# EAGLE design PinballBumper_DaughterBoard (EAGLE 9.0.1)
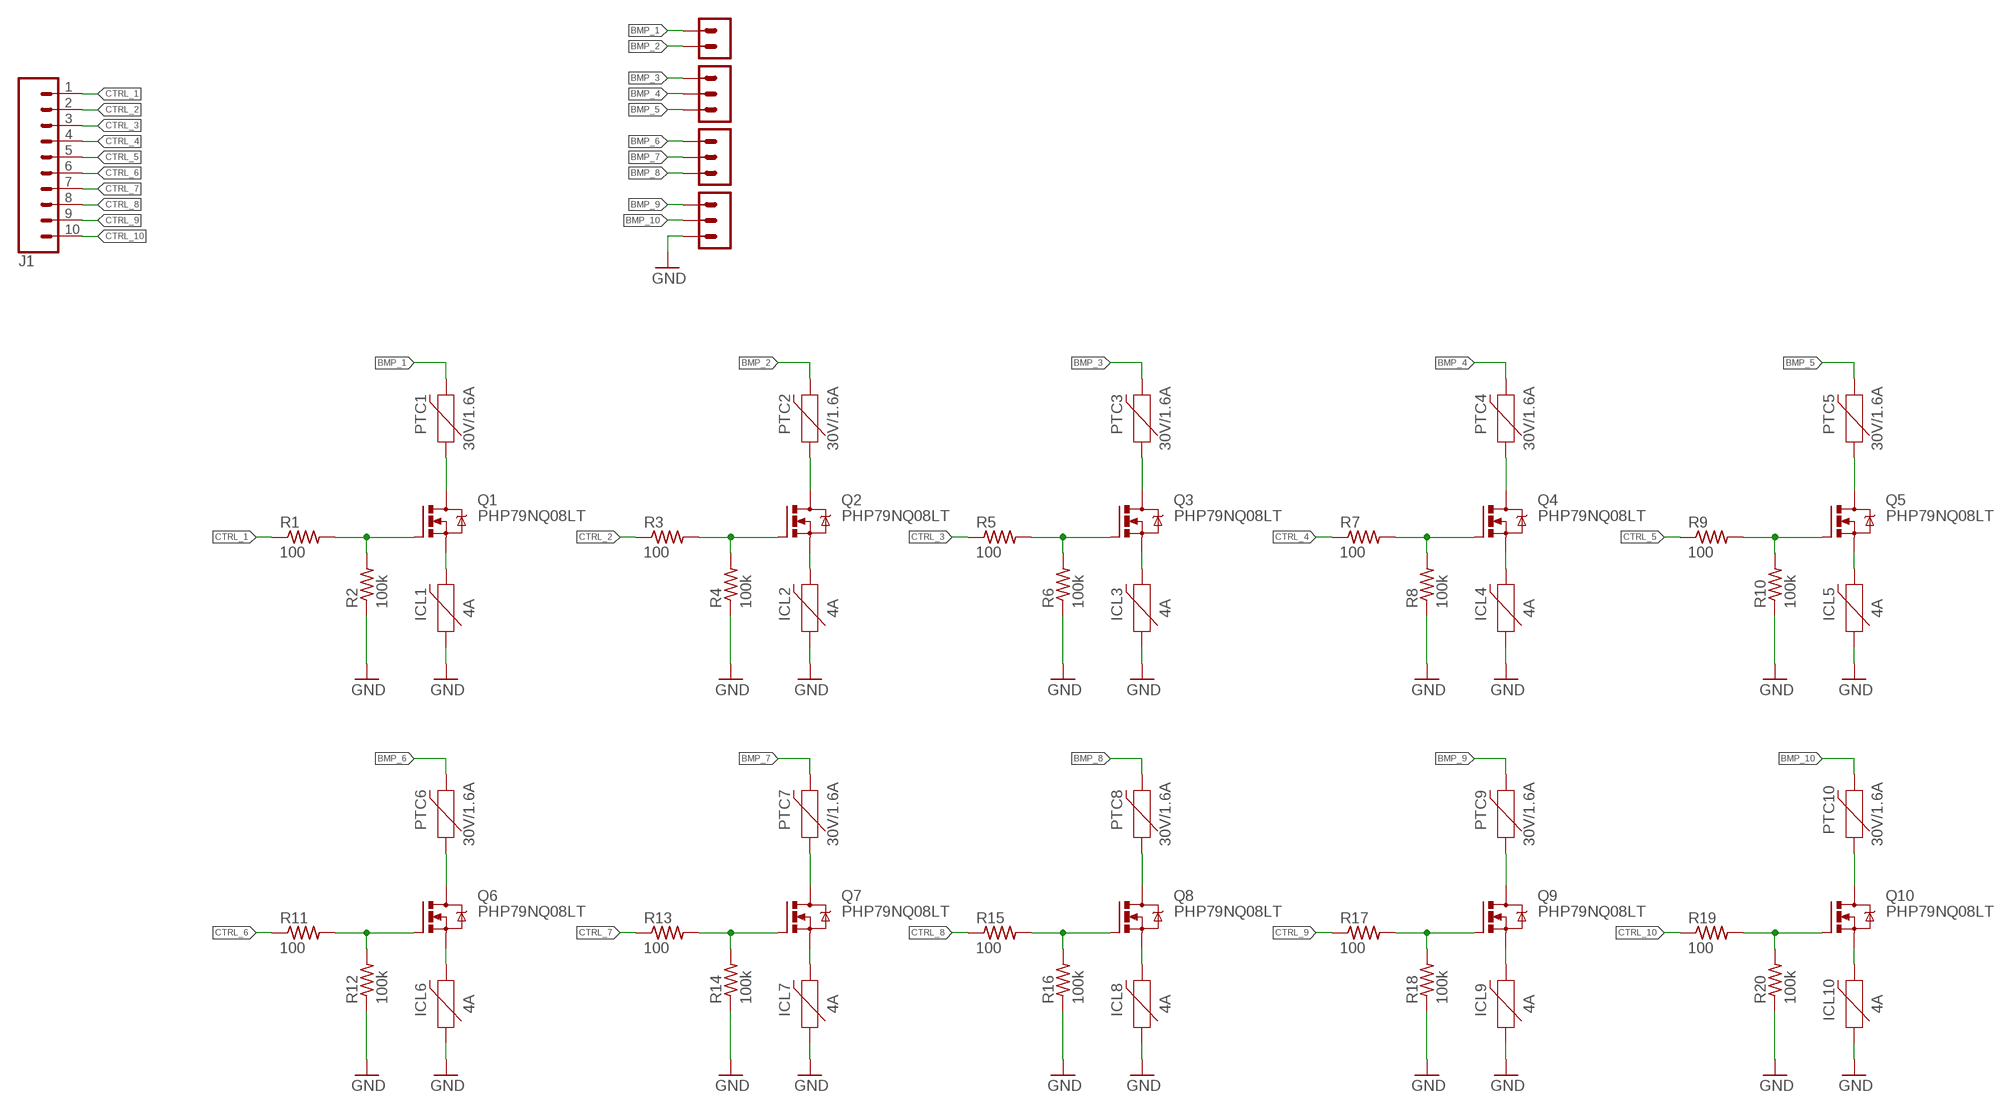
[diagram p0: schematic, sheet 1]

## Parts
ICL1  4A  PPTC_PTH  [PTH]
ICL2  4A  PPTC_PTH  [PTH]
ICL3  4A  PPTC_PTH  [PTH]
ICL4  4A  PPTC_PTH  [PTH]
ICL5  4A  PPTC_PTH  [PTH]
ICL6  4A  PPTC_PTH  [PTH]
ICL7  4A  PPTC_PTH  [PTH]
ICL8  4A  PPTC_PTH  [PTH]
ICL9  4A  PPTC_PTH  [PTH]
ICL10  4A  PPTC_PTH  [PTH]
J1  CONN_10"  [1X10]
PTC1  30V/1.6A  PPTC_PTH  [PTH]
PTC2  30V/1.6A  PPTC_PTH  [PTH]
PTC3  30V/1.6A  PPTC_PTH  [PTH]
PTC4  30V/1.6A  PPTC_PTH  [PTH]
PTC5  30V/1.6A  PPTC_PTH  [PTH]
PTC6  30V/1.6A  PPTC_PTH  [PTH]
PTC7  30V/1.6A  PPTC_PTH  [PTH]
PTC8  30V/1.6A  PPTC_PTH  [PTH]
PTC9  30V/1.6A  PPTC_PTH  [PTH]
PTC10  30V/1.6A  PPTC_PTH  [PTH]
Q1  PHP79NQ08LT  IRF740  [TO220BV]
Q2  PHP79NQ08LT  IRF740  [TO220BV]
Q3  PHP79NQ08LT  IRF740  [TO220BV]
Q4  PHP79NQ08LT  IRF740  [TO220BV]
Q5  PHP79NQ08LT  IRF740  [TO220BV]
Q6  PHP79NQ08LT  IRF740  [TO220BV]
Q7  PHP79NQ08LT  IRF740  [TO220BV]
Q8  PHP79NQ08LT  IRF740  [TO220BV]
Q9  PHP79NQ08LT  IRF740  [TO220BV]
Q10  PHP79NQ08LT  IRF740  [TO220BV]
R1  100  R-US_0204/7  [0204/7]
R2  100k  R-US_0204/7  [0204/7]
R3  100  R-US_0204/7  [0204/7]
R4  100k  R-US_0204/7  [0204/7]
R5  100  R-US_0204/7  [0204/7]
R6  100k  R-US_0204/7  [0204/7]
R7  100  R-US_0204/7  [0204/7]
R8  100k  R-US_0204/7  [0204/7]
R9  100  R-US_0204/7  [0204/7]
R10  100k  R-US_0204/7  [0204/7]
R11  100  R-US_0204/7  [0204/7]
R12  100k  R-US_0204/7  [0204/7]
R13  100  R-US_0204/7  [0204/7]
R14  100k  R-US_0204/7  [0204/7]
R15  100  R-US_0204/7  [0204/7]
R16  100k  R-US_0204/7  [0204/7]
R17  100  R-US_0204/7  [0204/7]
R18  100k  R-US_0204/7  [0204/7]
R19  100  R-US_0204/7  [0204/7]
R20  100k  R-US_0204/7  [0204/7]
U$1  BIG_TERMINAL_2PINBIG  [BIG_TERMINAL_2PIN]
U$2  BIG_TERMINAL_3PINBIG  [BIG_TERMINAL_3PIN]
U$3  BIG_TERMINAL_3PINBIG  [BIG_TERMINAL_3PIN]
U$4  BIG_TERMINAL_3PINBIG  [BIG_TERMINAL_3PIN]

## Nets
BMP_1: PTC1.P$2 U$1.P$1
BMP_2: PTC2.P$2 U$1.P$2
BMP_3: PTC3.P$2 U$2.1
BMP_4: PTC4.P$2 U$2.2
BMP_5: PTC5.P$2 U$2.3
BMP_6: PTC6.P$2 U$3.1
BMP_7: PTC7.P$2 U$3.2
BMP_8: PTC8.P$2 U$3.3
BMP_9: PTC9.P$2 U$4.1
BMP_10: PTC10.P$2 U$4.2
CTRL_1: J1.1 R1.1
CTRL_2: J1.2 R3.1
CTRL_3: J1.3 R5.1
CTRL_4: J1.4 R7.1
CTRL_5: J1.5 R9.1
CTRL_6: J1.6 R11.1
CTRL_7: J1.7 R13.1
CTRL_8: J1.8 R15.1
CTRL_9: J1.9 R17.1
CTRL_10: J1.10 R19.1
GND: ICL1.P$1 ICL2.P$1 ICL3.P$1 ICL4.P$1 ICL5.P$1 ICL6.P$1 ICL7.P$1 ICL8.P$1 ICL9.P$1 ICL10.P$1 R2.1 R4.1 R6.1 R8.1 R10.1 R12.1 R14.1 R16.1 R18.1 R20.1 U$4.3
N$1: PTC1.P$1 Q1.D
N$2: Q1.G R1.2 R2.2
N$3: ICL1.P$2 Q1.S
N$4: PTC2.P$1 Q2.D
N$5: Q2.G R3.2 R4.2
N$6: ICL2.P$2 Q2.S
N$7: PTC3.P$1 Q3.D
N$8: Q3.G R5.2 R6.2
N$9: ICL3.P$2 Q3.S
N$10: PTC4.P$1 Q4.D
N$11: Q4.G R7.2 R8.2
N$12: ICL4.P$2 Q4.S
N$13: PTC5.P$1 Q5.D
N$14: Q5.G R9.2 R10.2
N$15: ICL5.P$2 Q5.S
N$16: PTC6.P$1 Q6.D
N$17: Q6.G R11.2 R12.2
N$18: ICL6.P$2 Q6.S
N$19: PTC7.P$1 Q7.D
N$20: Q7.G R13.2 R14.2
N$21: ICL7.P$2 Q7.S
N$22: PTC8.P$1 Q8.D
N$23: Q8.G R15.2 R16.2
N$24: ICL8.P$2 Q8.S
N$25: PTC9.P$1 Q9.D
N$26: Q9.G R17.2 R18.2
N$27: ICL9.P$2 Q9.S
N$28: PTC10.P$1 Q10.D
N$29: Q10.G R19.2 R20.2
N$30: ICL10.P$2 Q10.S

## Library data of the parts
ICL1-ICL10 PTC1-PTC10 = SparkFun-Fuses:PPTC: Resettable Fuse PPTC Resettable Fuse. Really a sort of resistor with a polymeric positive temperature coefficient whose resistance increases dramatically with an increase in temperature. When heated by the power passing through the resistance rises causing the current to be limited, protecting the circuit. This is achieved by the transition of the polymer from a crystalline to an amorphous state where the conductive carbon separates breaking the conductive pathways found in the cool crystalline structure. When a PPTC cools back down it resumes conducting letting the circuit turn back on. SparkFun Products: SparkFun RedBoard - Programmed with Arduino <https://www.sparkfun.com/products/12757> Pro Micro - 5V/16MHz <https://www.sparkfun.com/products/12640> Arduino Pro 328 - 5V/16MHz <https://www.sparkfun.com/products/10915> MP3 Trigger <https://www.sparkfun.com/products/13720>; PROD_ID: RES-08490; VALUE: 72V/0.25A
J1 = SparkFun-Connectors:CONN_10: Multi connection point. Often used as Generic Header-pin footprint for 0.1 inch spaced/style header connections On any of the 0.1 inch spaced packages, you can populate with these: Break Away Headers - Straight <https://www.sparkfun.com/products/116> (PRT-00116) Break Away Male Headers - Right Angle <https://www.sparkfun.com/products/553> (PRT-00553) Female Headers <https://www.sparkfun.com/products/115> (PRT-00115) Break Away Headers - Machine Pin <https://www.sparkfun.com/products/117> (PRT-00117) Break Away Female Headers - Swiss Machine Pin <https://www.sparkfun.com/products/743> (PRT-00743) Arduino Stackable Header - 10 Pin <https://www.sparkfun.com/products/11376> (PRT-11376) For SCREWTERMINALS and SPRING TERMINALS visit here: Screw Terimnals on SparkFun.com <https://www.sparkfun.com/search/results?term=Screw+Terminals> (5mm/3.5mm/2.54mm spacing) This device is also useful as a general connection point to wire up your design to another part of your project. Our various solder wires solder well into these plated through hole pads. Hook-Up Wire - Assortment (Stranded, 22 AWG) <https://www.sparkfun.com/products/11375> (PRT-11375) Hook-Up Wire - Assortment (Solid Core, 22 AWG) <https://www.sparkfun.com/products/11367> (PRT-11367) View the entire wire category on our website here <https://www.sparkfun.com/categories/141> Special notes: Molex polarized connector foot print use with SKU : PRT-08231 with associated crimp pins and housings. 1MM SMD Version SKU: PRT-10208 NOTES ON THE VARIANTS LOCK and LOCK_LONGPADS... This footprint was designed to help hold the alignment of a through-hole component (i.e. 6-pin header) while soldering it into place. You may notice that each hole has been shifted either up or down by 0.005 of an inch from it's more standard position (which is a perfectly straight line). This slight alteration caused the pins (the squares in the middle) to touch the edges of the holes. Because they are alternating, it causes a "brace" to hold the component in place. 0.005 has proven to be the perfect amount of "off-center" position when using our standard breakaway headers. Although looks a little odd when you look at the bare footprint, once you have a header in there, the alteration is very hard to notice. Also,if you push a header all the way into place, it is covered up entirely on the bottom side.; PROD_ID: CONN-11563
Q1-Q10 = transistor-power:IRF740: N-CHANNEL MOS FET
R1-R20 = rcl:R-US_: RESISTOR, American symbol; SPICEPREFIX: R
U$1 = EzerLonginus:BIG_TERMINAL_2PIN
U$2-U$4 = EzerLonginus:BIG_TERMINAL_3PIN

## Board
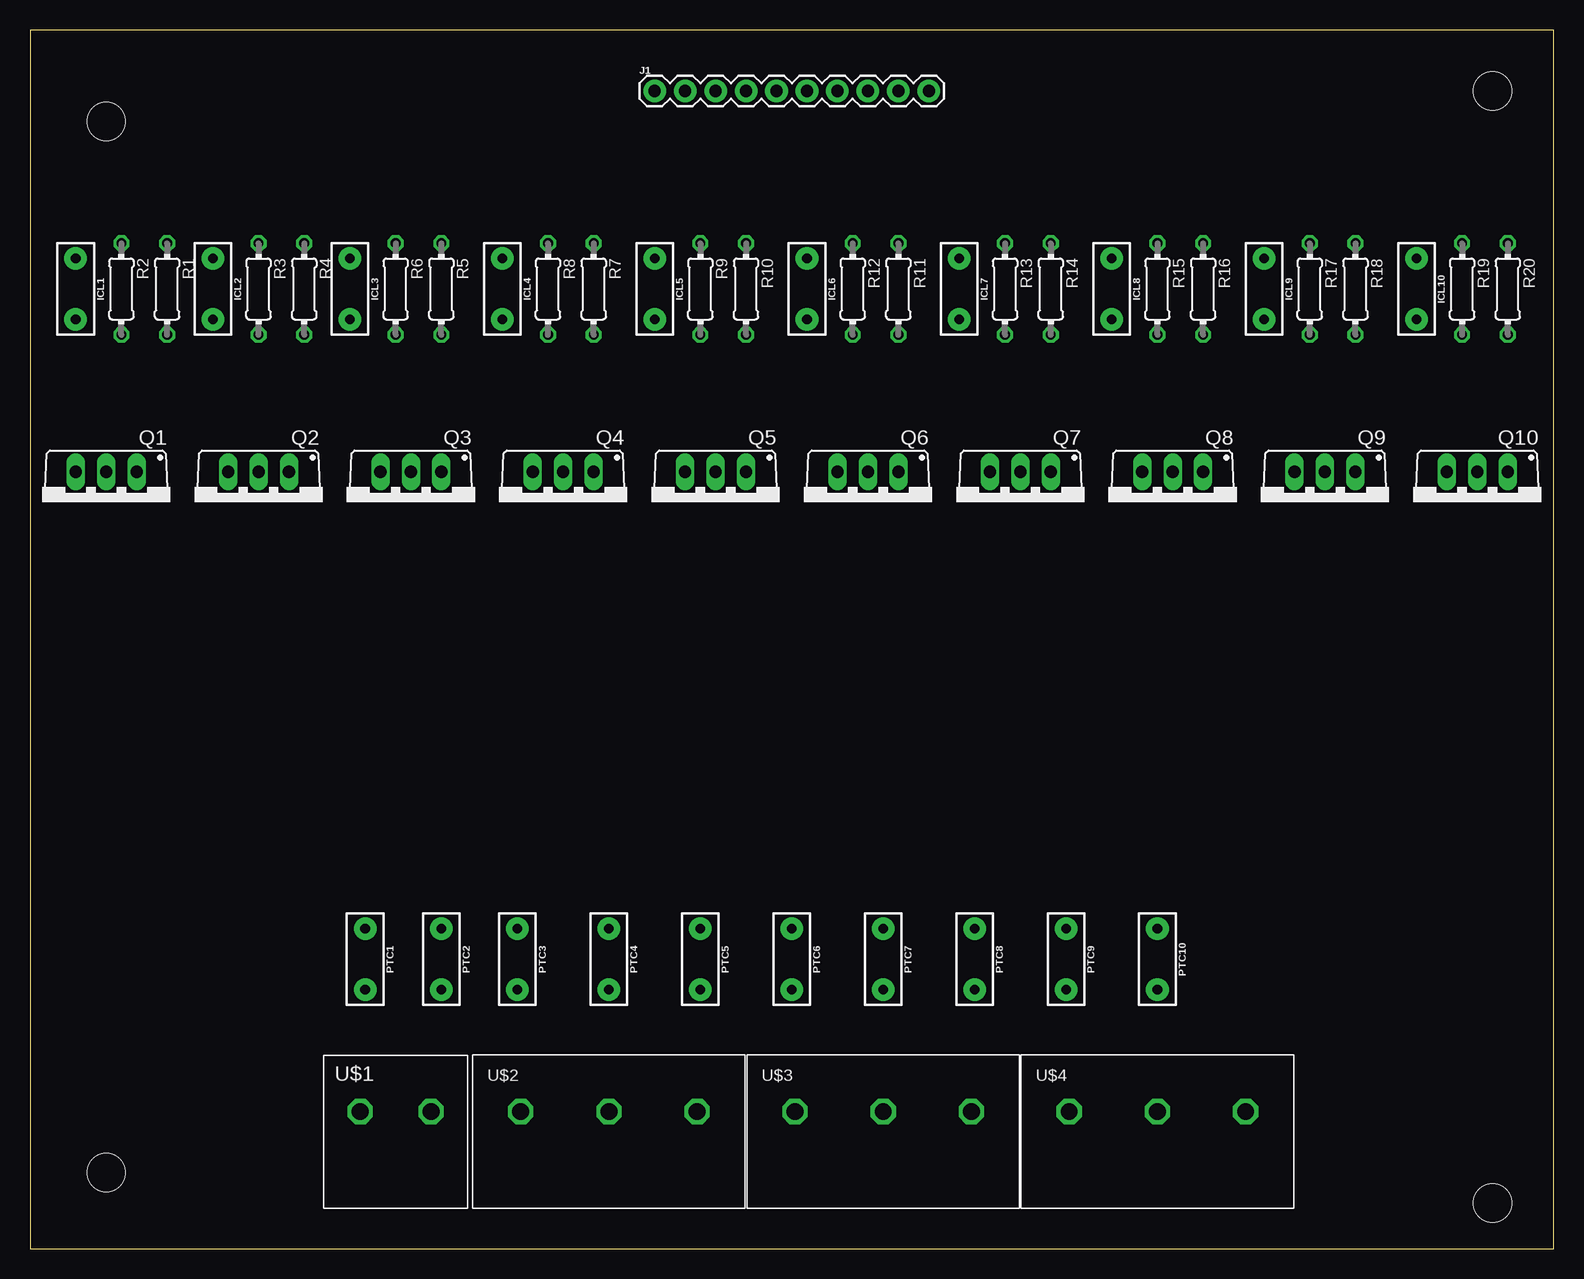
[diagram p1: board, top side]
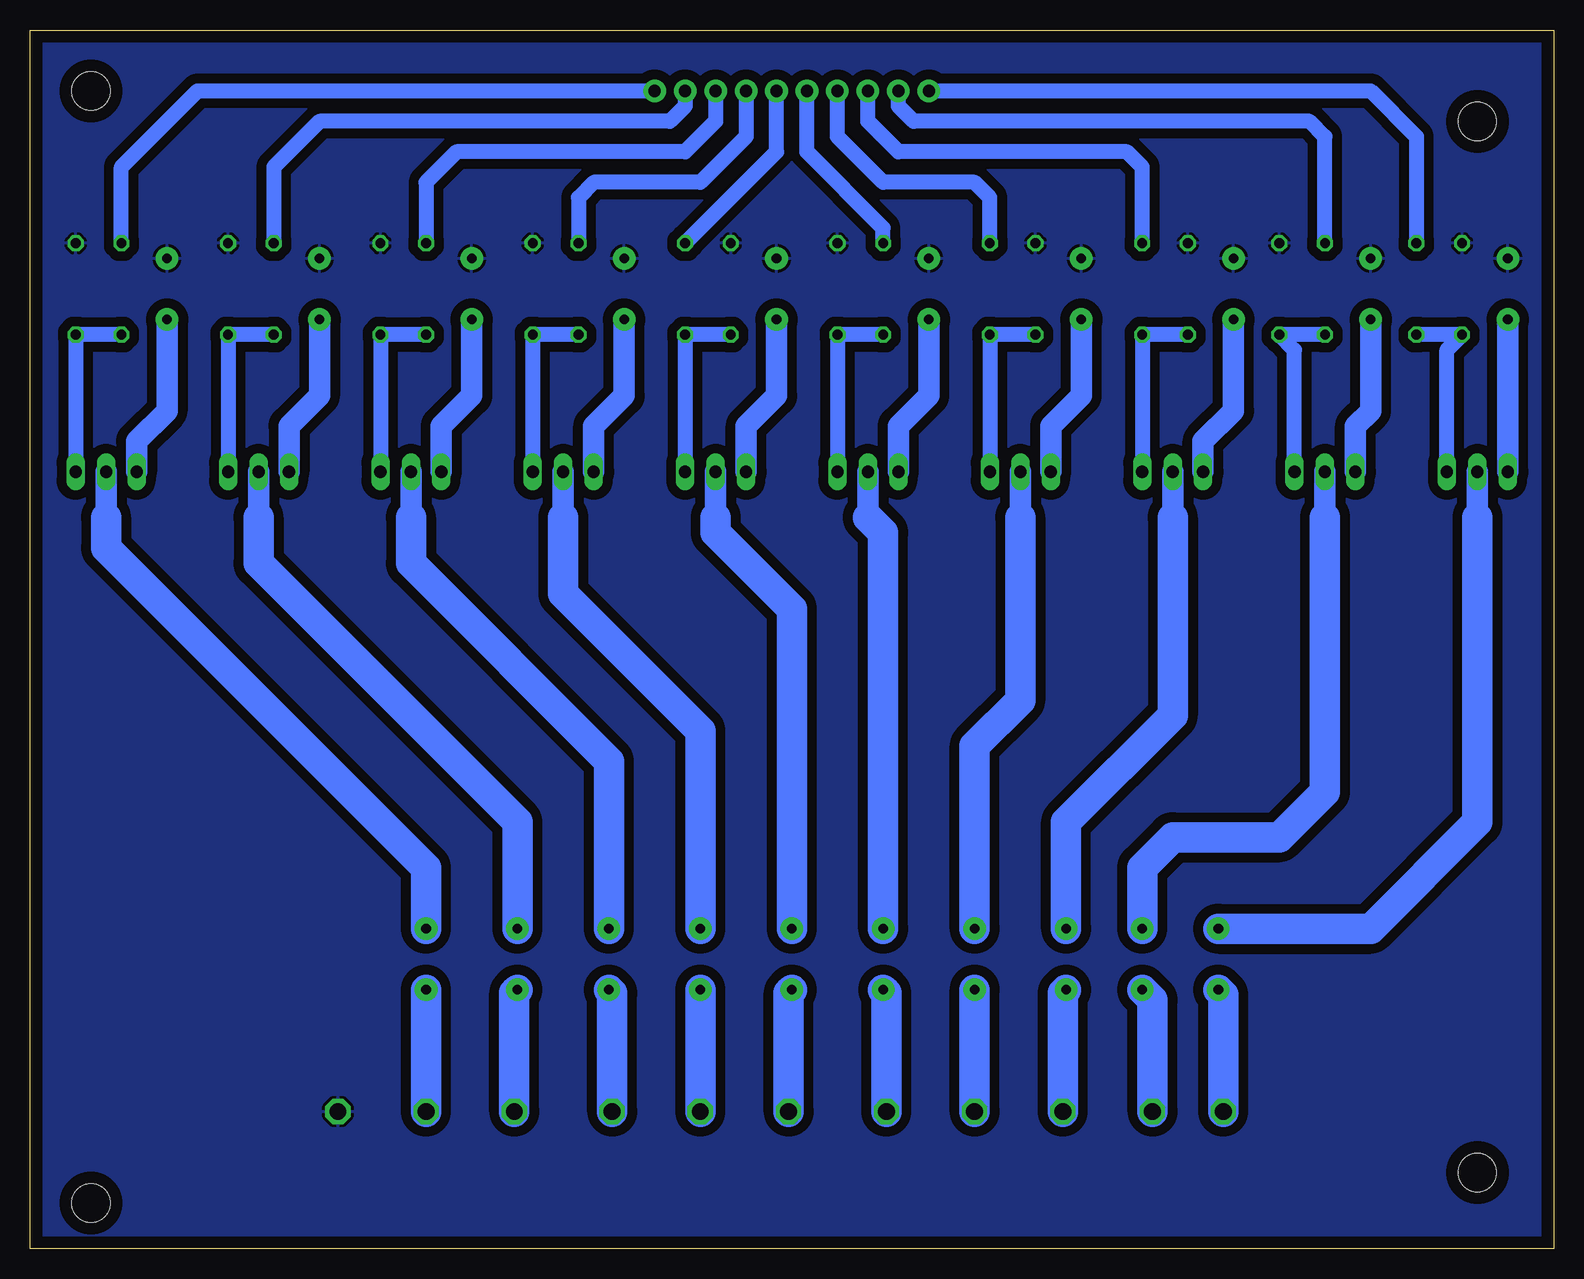
[diagram p2: board, bottom side, seen from below]

Size 127 x 101.6 mm. Coordinates in mm from the lower left corner, seen from the top.
Outline: 0,0 127,0 127,101.6 0,101.6 0,0
Copper layers (1*16): Top 0.035mm / dielectric 1.5mm / Bottom 0.035mm
Design rules "default": minimum track width 6mil, minimum drill 0.35mm, track to track 6mil, track to pad 6mil, pad to pad 6mil, via to via 6mil, smd to smd 6mil, copper to edge 40mil, drill to drill 6mil, minimum pad ring 10mil, minimum via ring 8mil, stop-mask expansion 4mil, vias tented up to drill 0mil, thermal gap 10mil
Holes 3.17 mm at 6.35,93.98 6.35,6.35 121.92,96.52 121.92,3.81

### Footprints (pad centres in the part's own frame; a part is rotated, then mirrored left to right if it is on the bottom)
PTH = drill 0.8 pad 1.88: P$1 -2.54,0; P$2 2.54,0
1X10 = drill 1.016 pad 1.88: 1 0,0; 2 2.54,0; 3 5.08,0; 4 7.62,0; 5 10.16,0; 6 12.7,0; 7 15.24,0; 8 17.78,0; 9 20.32,0; 10 22.86,0
TO220BV = drill 1.016 long: D 0,-2.54; G -2.54,-2.54; S 2.54,-2.54
0204/7 = drill 0.813 octagon: 1 -3.81,0; 2 3.81,0
BIG_TERMINAL_2PIN = drill 1.397 octagon: P$1 -2.953,0; P$2 2.953,0
BIG_TERMINAL_3PIN = drill 1.397 octagon: 1 -7.353,0; 2 0,0; 3 7.353,0

### Placement (x,y rotation side)
ICL1  3.81,80.01 270 top
ICL2  15.24,80.01 270 top
ICL3  26.67,80.01 270 top
ICL4  39.37,80.01 270 top
ICL5  52.07,80.01 270 top
ICL6  64.77,80.01 270 top
ICL7  77.47,80.01 270 top
ICL8  90.17,80.01 270 top
ICL9  102.87,80.01 270 top
ICL10  115.57,80.01 270 top
J1  52.07,96.52 0 top
PTC1  27.94,24.13 270 top
PTC2  34.29,24.13 270 top
PTC3  40.64,24.13 270 top
PTC4  48.26,24.13 270 top
PTC5  55.88,24.13 270 top
PTC6  63.5,24.13 270 top
PTC7  71.12,24.13 270 top
PTC8  78.74,24.13 270 top
PTC9  86.36,24.13 270 top
PTC10  93.98,24.13 270 top
Q1  6.35,62.23 180 top
Q2  19.05,62.23 180 top
Q3  31.75,62.23 180 top
Q4  44.45,62.23 180 top
Q5  57.15,62.23 180 top
Q6  69.85,62.23 180 top
Q7  82.55,62.23 180 top
Q8  95.25,62.23 180 top
Q9  107.95,62.23 180 top
Q10  120.65,62.23 180 top
R1  11.43,80.01 270 top
R2  7.62,80.01 270 top
R3  19.05,80.01 270 top
R4  22.86,80.01 270 top
R5  34.29,80.01 270 top
R6  30.48,80.01 270 top
R7  46.99,80.01 270 top
R8  43.18,80.01 270 top
R9  55.88,80.01 270 top
R10  59.69,80.01 270 top
R11  72.39,80.01 270 top
R12  68.58,80.01 270 top
R13  81.28,80.01 270 top
R14  85.09,80.01 270 top
R15  93.98,80.01 270 top
R16  97.79,80.01 270 top
R17  106.68,80.01 270 top
R18  110.49,80.01 270 top
R19  119.38,80.01 270 top
R20  123.19,80.01 270 top
U$1  30.48,11.43 0 top
U$2  48.26,11.43 0 top
U$3  71.12,11.43 0 top
U$4  93.98,11.43 0 top

### Tracks (layer width: path | path; a pad name or v marks a point on that pad's centre or on a via)
BMP_1
  Bottom 2.54: U$1.P$1 27.53,21.18 PTC1.P$2
BMP_2
  Bottom 2.54: U$1.P$2 33.43,20.73 PTC2.P$2
BMP_3
  Bottom 2.54: U$2.1 40.91,21.32 PTC3.P$2
BMP_4
  Bottom 2.54: U$2.2 PTC4.P$2
BMP_5
  Bottom 2.54: U$2.3 55.61,21.32 PTC5.P$2
BMP_6
  Bottom 2.54: U$3.1 63.77,21.32 PTC6.P$2
BMP_7
  Bottom 2.54: U$3.2 PTC7.P$2
BMP_8
  Bottom 2.54: U$3.3 78.47,21.32 PTC8.P$2
BMP_9
  Bottom 2.54: U$4.1 86.63,21.32 PTC9.P$2
BMP_10
  Bottom 2.54: U$4.2 PTC10.P$2
CTRL_1
  Bottom 1.27: J1.1 15.24,96.52 11.43,92.71 R1.1
CTRL_2
  Bottom 1.27: J1.2 54.61,95.25 53.34,93.98 20.32,93.98 19.05,92.71 R3.1
CTRL_3
  Bottom 1.27: J1.3 57.15,93.98 54.61,91.44 35.56,91.44 34.29,90.17 R5.1
CTRL_4
  Bottom 1.27: J1.4 59.69,92.71 55.88,88.9 48.26,88.9 46.99,87.63 R7.1
CTRL_5
  Bottom 1.27: R9.1 55.88,85.09 62.23,91.44 J1.5
CTRL_6
  Bottom 1.27: R11.1 64.77,91.44 J1.6
CTRL_7
  Bottom 1.27: J1.7 67.31,92.71 71.12,88.9 80.01,88.9 81.28,87.63 R13.1
CTRL_8
  Bottom 1.27: J1.8 69.85,93.98 72.39,91.44 91.44,91.44 93.98,88.9 R15.1
CTRL_9
  Bottom 1.27: J1.9 72.39,95.25 73.66,93.98 102.87,93.98 106.68,90.17 R17.1
CTRL_10
  Bottom 1.27: R19.1 119.38,90.17 113.03,96.52 J1.10
GND
  pour Bottom (isolate 0.813): 0,101.6 127,101.6 127,0 0,0
N$1
  Bottom 1.778: Q1.D 6.35,60.96
  Bottom 2.54: 6.35,60.96 6.35,35.56 15.24,26.67 PTC1.P$1
N$2
  Bottom 1.27: Q1.G 8.89,74.93 R2.2 R1.2
N$3
  Bottom 1.778: Q1.S ICL1.P$2
N$4
  Bottom 1.778: Q2.D 19.05,60.96
  Bottom 2.54: PTC2.P$1 34.29,31.75 31.75,34.29 22.86,34.29 19.05,38.1 19.05,60.96
N$5
  Bottom 1.27: Q2.G 21.59,74.93 R4.2 R3.2
N$6
  Bottom 1.778: Q2.S 16.51,68.58 15.24,69.85 ICL2.P$2
N$7
  Bottom 1.778: Q3.D 31.75,60.96
  Bottom 2.54: PTC3.P$1 40.64,35.56 31.75,44.45 31.75,60.96
N$8
  Bottom 1.27: R6.2 R5.2 Q3.G
N$9
  Bottom 1.778: Q3.S 29.21,67.31 26.67,69.85 ICL3.P$2
N$10
  Bottom 1.778: Q4.D 44.45,60.96
  Bottom 2.54: PTC4.P$1 48.26,41.91 44.45,45.72 44.45,60.96
N$11
  Bottom 1.27: R8.2 R7.2 Q4.G
N$12
  Bottom 1.778: Q4.S 41.91,68.58 39.37,71.12 ICL4.P$2
N$13
  Bottom 1.778: Q5.D 57.15,60.96
  Bottom 2.54: 57.15,60.96 55.88,59.69 PTC5.P$1
N$14
  Bottom 1.27: R9.2 R10.2 Q5.G
N$15
  Bottom 1.778: Q5.S 54.61,68.58 52.07,71.12 ICL5.P$2
N$16
  Bottom 1.778: Q6.D 69.85,60.96
  Bottom 2.54: PTC6.P$1 63.5,53.34 69.85,59.69 69.85,60.96
N$17
  Bottom 1.27: R12.2 R11.2 Q6.G
N$18
  Bottom 1.778: Q6.S 67.31,68.58 64.77,71.12 ICL6.P$2
N$19
  Bottom 1.778: Q7.D 82.55,60.96
  Bottom 2.54: PTC7.P$1 71.12,43.18 82.55,54.61 82.55,60.96
N$20
  Bottom 1.27: R13.2 R14.2 Q7.G
N$21
  Bottom 1.778: Q7.S 80.01,68.58 77.47,71.12 ICL7.P$2
N$22
  Bottom 1.778: Q8.D 95.25,60.96
  Bottom 2.54: PTC8.P$1 78.74,40.64 95.25,57.15 95.25,60.96
N$23
  Bottom 1.27: R15.2 R16.2 Q8.G
N$24
  Bottom 1.778: ICL8.P$2 90.17,71.12 92.71,68.58 Q8.S
N$25
  Bottom 1.778: Q9.D 107.95,60.96
  Bottom 2.54: PTC9.P$1 86.36,35.56 107.95,57.15 107.95,60.96
N$26
  Bottom 1.27: R17.2 R18.2 Q9.G
N$27
  Bottom 1.778: ICL9.P$2 102.87,71.12 105.41,68.58 Q9.S
N$28
  Bottom 1.778: Q10.D 120.65,60.96
  Bottom 2.54: PTC10.P$1 93.98,31.75 120.65,58.42 120.65,60.96
N$29
  Bottom 1.27: R19.2 R20.2 Q10.G
N$30
  Bottom 1.778: ICL10.P$2 115.57,69.85 118.11,67.31 Q10.S